# Altium project CAMERON.PrjPcb
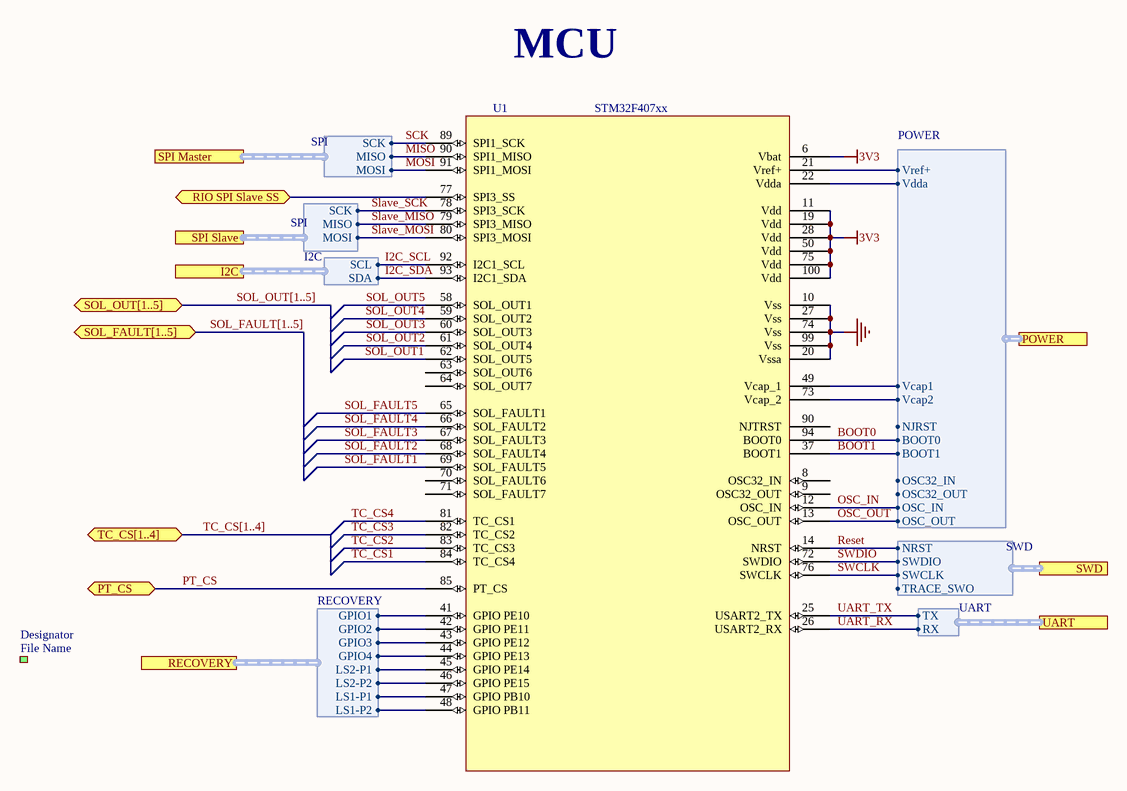
[diagram p0: RIO_MCU.SchDoc]
7 sheets, 17 parts. Net scope: hierarchical (ports join the sheet entries above them; power ports are global).
Board file: CAMERON.PcbDoc
Sheets:
  RIO_MCU.SchDoc
  SWD_Breakout.SchDoc
  Thermocouples.SchDoc
  Solenoids.SchDoc
  Flight_Computer.SchDoc
  XBee.SchDoc
  Power_Monitor.SchDoc

## Sheet RIO_MCU.SchDoc
size Letter; Organization: Altium Limited; Address1: L3, 12a Rodborough Rd; Address2: Frenchs Forest; Address3: NSW; Address4: Australia 2086

### Parts
U1  STM32F407xx  [LQFP100]

### Sub-sheets
Designator = File Name (file not in this document): no entries

### Ports
I2C (harness I2C), POWER (harness POWER), PT_CS (bidir), RECOVERY (harness RECOVERY), RIO SPI Slave SS (bidir), SOL_FAULT[1..5] (bidir), SOL_OUT[1..5] (bidir), SPI Master (harness SPI), SPI Slave (harness SPI), SWD (harness SWD), TC_CS[1..4] (bidir), UART (harness UART)

### Harnesses
I2C: SCL, SDA
SWD: NRST, SWDIO, SWCLK, TRACE_SWO
POWER: Vdda, Vref+, Vcap1, Vcap2, NJRST, BOOT0, BOOT1, OSC32_IN, OSC32_OUT, OSC_IN, OSC_OUT
SPI: SCK, MISO, MOSI
SPI: MISO, MOSI, SCK
UART: RX, TX
RECOVERY: GPIO1, GPIO2, GPIO3, GPIO4, LS1-P1, LS1-P2, LS2-P1, LS2-P2

### Nets
3V3: U1.6(Vbat) U1.11(Vdd) U1.19(Vdd) U1.28(Vdd) U1.50(Vdd) U1.75(Vdd) U1.100(Vdd)
GND: U1.10(Vss) U1.20(Vssa) U1.27(Vss) U1.74(Vss) U1.99(Vss)
BOOT0: U1.94(BOOT0) ; port POWER.BOOT0
BOOT1: U1.37(BOOT1) ; port POWER.BOOT1
I2C_SCL: U1.92(I2C1_SCL) ; port I2C.SCL
I2C_SDA: U1.93(I2C1_SDA) ; port I2C.SDA
MISO: U1.90(NJTRST) ; port SPI Master.MISO
MOSI: U1.91(SPI1_MOSI) ; port SPI Master.MOSI
OSC_IN: U1.12(OSC_IN) ; port POWER.OSC_IN
OSC_OUT: U1.13(OSC_OUT) ; port POWER.OSC_OUT
PT_CS: U1.85(PT_CS) ; port PT_CS
Reset: U1.14(NRST) ; port SWD.NRST
SCK: U1.89(SPI1_SCK) ; port SPI Master.SCK
Slave_MISO: U1.79(SPI3_MISO) ; port SPI Slave.MISO
Slave_MOSI: U1.80(SPI3_MOSI) ; port SPI Slave.MOSI
Slave_SCK: U1.78(SPI3_SCK) ; port SPI Slave.SCK
SOL_FAULT1: U1.69(SOL_FAULT5)
SOL_FAULT2: U1.68(SOL_FAULT4)
SOL_FAULT3: U1.67(SOL_FAULT3)
SOL_FAULT4: U1.66(SOL_FAULT2)
SOL_FAULT5: U1.65(SOL_FAULT1)
SOL_OUT1: U1.62(SOL_OUT5)
SOL_OUT2: U1.61(SOL_OUT4)
SOL_OUT3: U1.60(SOL_OUT3)
SOL_OUT4: U1.59(SOL_OUT2)
SOL_OUT5: U1.58(SOL_OUT1)
SWCLK: U1.76(SWCLK) ; port SWD.SWCLK
SWDIO: U1.72(SWDIO) ; port SWD.SWDIO
TC_CS1: U1.84(TC_CS4)
TC_CS2: U1.83(TC_CS3)
TC_CS3: U1.82(TC_CS2)
TC_CS4: U1.81(TC_CS1)
UART_RX: U1.26(USART2_RX) ; port UART.RX
UART_TX: U1.25(USART2_TX) ; port UART.TX
NetU1_21: U1.21(Vref+) ; port POWER.Vref+
NetU1_22: U1.22(Vdda) ; port POWER.Vdda
NetU1_41: U1.41(GPIO_PE10) ; port RECOVERY.GPIO1
NetU1_42: U1.42(GPIO_PE11) ; port RECOVERY.GPIO2
NetU1_43: U1.43(GPIO_PE12) ; port RECOVERY.GPIO3
NetU1_44: U1.44(GPIO_PE13) ; port RECOVERY.GPIO4
NetU1_45: U1.45(GPIO_PE14) ; port RECOVERY.LS2-P1
NetU1_46: U1.46(GPIO_PE15) ; port RECOVERY.LS2-P2
NetU1_47: U1.47(GPIO_PB10) ; port RECOVERY.LS1-P1
NetU1_48: U1.48(GPIO_PB11) ; port RECOVERY.LS1-P2
NetU1_49: U1.49(Vcap_1) ; port POWER.Vcap1
NetU1_73: U1.73(Vcap_2) ; port POWER.Vcap2
NetU1_77: U1.77(SPI3_SS) ; port RIO SPI Slave SS

Not connected (* = marked no-connect by the designer): U1 8(OSC32_IN) 9(OSC32_OUT) 63(SOL_OUT6) 64(SOL_OUT7) 70(SOL_FAULT6) 71(SOL_FAULT7)

### Buses and harness runs
bus SOL_FAULT[1..5] = port SOL_FAULT[1..5]
bus SOL_OUT[1..5] = port SOL_OUT[1..5]
bus TC_CS[1..4] = port TC_CS[1..4]

### Notes on the sheet
- MCU
- Title
- Size:
- Date:
- Letter
- Number:
- Time:
- Revision:
- Sheet
- of
- File:

## Sheet SWD_Breakout.SchDoc
size Letter; Organization: Altium Limited; Address1: L3, 12a Rodborough Rd; Address2: Frenchs Forest; Address3: NSW; Address4: Australia 2086
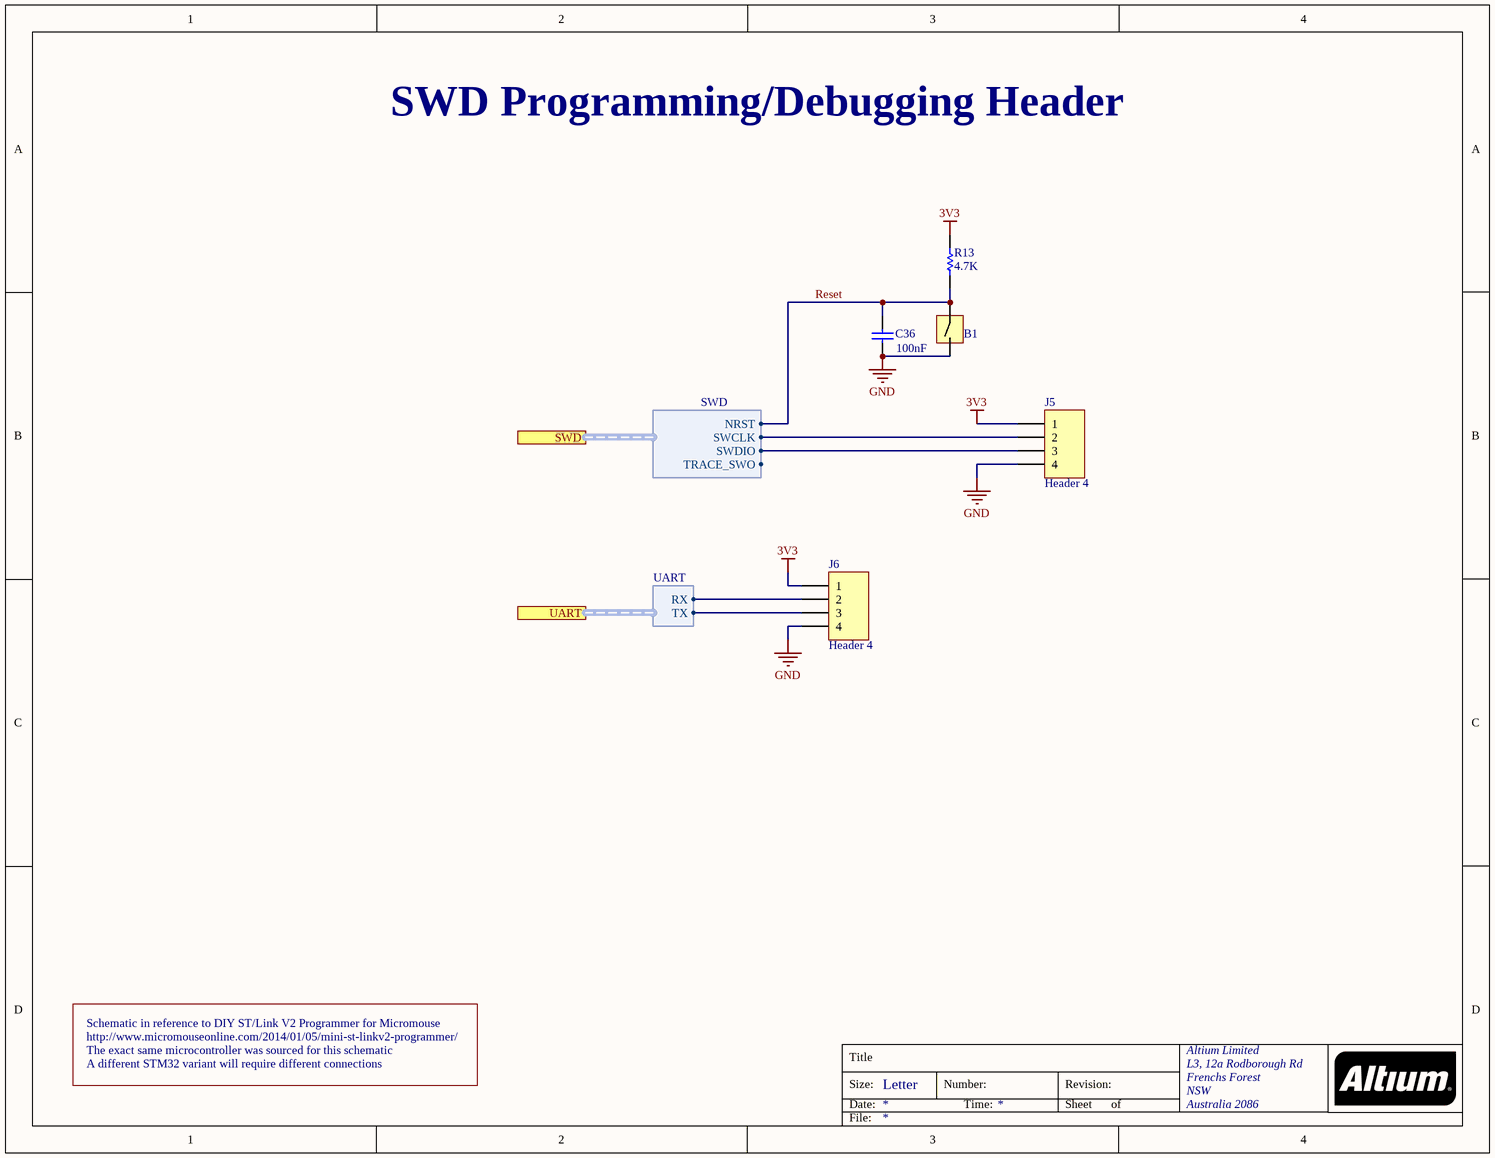
[diagram p1: SWD_Breakout.SchDoc]

### Parts
B1  Push Button  [PUSHBUTTON]  (value not drawn)
C36  value 100nF  [0603]  (hidden comment: Cap)
J5  Header 4  [HDR1X4]
J6  Header 4  [HDR1X4]
R13  value 4.7K  [0603]  (hidden comment: Res1)

### Ports
SWD (harness SWD), UART (harness UART)

### Harnesses
SWD: NRST, SWCLK, SWDIO, TRACE_SWO
UART: RX, TX

### Nets
3V3: J5.1 J6.1 R13.2
GND: B1.2 C36.1 J5.4 J6.4
Reset: B1.1 C36.2 R13.1 ; port SWD.NRST
NetJ5_2: J5.2 ; port SWD.SWCLK
NetJ5_3: J5.3 ; port SWD.SWDIO
NetJ6_2: J6.2 ; port UART.RX
NetJ6_3: J6.3 ; port UART.TX

### Notes on the sheet
- SWD Programming/Debugging Header
- http://www.micromouseonline.com/2014/01/05/mini-st-linkv2-programmer/
- Schematic in reference to DIY ST/Link V2 Programmer for Micromouse
- The exact same microcontroller was sourced for this schematic
- A different STM32 variant will require different connections
- Title
- Size:
- Date:
- Letter
- Number:
- Time:
- Revision:
- Sheet
- of
- File:

### Library data of the parts
B1 = PushButton
C36 = Cap: Capacitor
J5 J6 = Header 4: Header, 4-Pin; LatestRevisionDate: 17-Jul-2002; LatestRevisionNote: Re-released for DXP Platform.; Publisher: Altium Limited
R13 = Res1: Resistor

## Sheet Thermocouples.SchDoc
size Letter; Organization: Altium Limited; Address1: L3, 12a Rodborough Rd; Address2: Frenchs Forest; Address3: NSW; Address4: Australia 2086
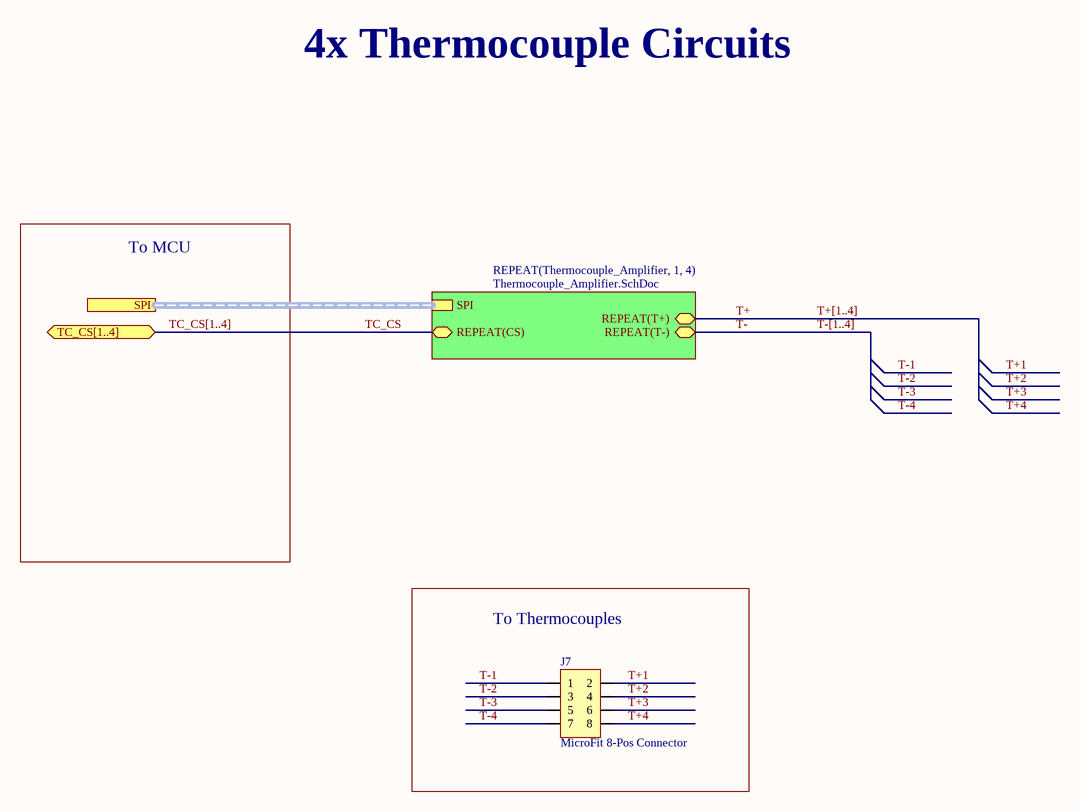
[diagram p2: Thermocouples.SchDoc]

### Parts
J7  MicroFit 8-Pos Connector  [Microfit-8Pos]

### Blocks framed on the sheet
To Thermocouples: J7

### Sub-sheets
REPEAT(Thermocouple_Amplifier, 1, 4) = Thermocouple_Amplifier.SchDoc (file not in this document): SPI (harness SPI), REPEAT(CS) (bidir), REPEAT(T+) (bidir), REPEAT(T-) (bidir)

### Ports
SPI (harness SPI), TC_CS[1..4] (bidir)

### Nets
T+: sheet REPEAT(Thermocouple_Amplifier, 1, 4)/REPEAT(T+)
T+1: J7.2
T+2: J7.4
T+3: J7.6
T+4: J7.8
T-: sheet REPEAT(Thermocouple_Amplifier, 1, 4)/REPEAT(T-)
T-1: J7.1
T-2: J7.3
T-3: J7.5
T-4: J7.7
TC_CS: sheet REPEAT(Thermocouple_Amplifier, 1, 4)/REPEAT(CS)

### Buses and harness runs
bus T+[1..4]
bus T-[1..4]
bus TC_CS[1..4] = port TC_CS[1..4]
harness port SPI = sheet REPEAT(Thermocouple_Amplifier, 1, 4)/SPI

### Notes on the sheet
- 4x Thermocouple Circuits
- To MCU
- Title
- Size:
- Date:
- Letter
- Number:
- Time:
- Revision:
- Sheet
- of
- File:

### Library data of the parts
J7 = Micro-Fit 8Pos: Molex MicroFit 8-Pos Connector; URL: https://www.digikey.com/products/en?WT.z_cid=sp_900_0310_buynow&keywords=430450813; DigiKey PN: WM2651-ND

## Sheet Solenoids.SchDoc
size Letter; Organization: Altium Limited; Address1: L3, 12a Rodborough Rd; Address2: Frenchs Forest; Address3: NSW; Address4: Australia 2086
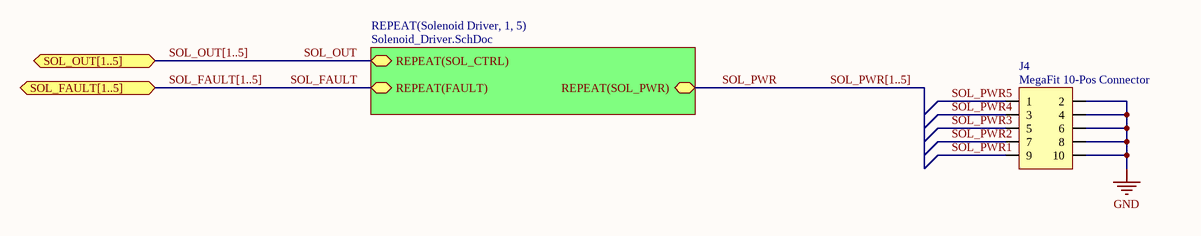
[diagram p3: Solenoids.SchDoc]

### Parts
J4  MegaFit 10-Pos Connector  [MegaFit-10Pos]

### Sub-sheets
REPEAT(Solenoid Driver, 1, 5) = Solenoid_Driver.SchDoc (file not in this document): REPEAT(FAULT) (bidir), REPEAT(SOL_CTRL) (bidir), REPEAT(SOL_PWR) (bidir)

### Ports
SOL_FAULT[1..5] (bidir), SOL_OUT[1..5] (bidir)

### Nets
GND: J4.2 J4.4 J4.6 J4.8 J4.10
SOL_FAULT: sheet REPEAT(Solenoid Driver, 1, 5)/REPEAT(FAULT)
SOL_OUT: sheet REPEAT(Solenoid Driver, 1, 5)/REPEAT(SOL_CTRL)
SOL_PWR: sheet REPEAT(Solenoid Driver, 1, 5)/REPEAT(SOL_PWR)
SOL_PWR1: J4.9
SOL_PWR2: J4.7
SOL_PWR3: J4.5
SOL_PWR4: J4.3
SOL_PWR5: J4.1

### Buses and harness runs
bus SOL_FAULT[1..5] = port SOL_FAULT[1..5]
bus SOL_OUT[1..5] = port SOL_OUT[1..5]
bus SOL_PWR[1..5]

### Notes on the sheet
- Title
- Size:
- Date:
- Letter
- Number:
- Time:
- Revision:
- Sheet
- of
- File:

### Library data of the parts
J4 = Mega-Fit 10Pos: Molex MegaFit 10-Pos Connector; URL: https://www.digikey.com/product-detail/en/molex-llc/0768290010/WM11979-ND/5639621; DigiKey PN: WM11979-ND

## Sheet Flight_Computer.SchDoc
size Letter; Organization: Altium Limited; Address1: L3, 12a Rodborough Rd; Address2: Frenchs Forest; Address3: NSW; Address4: Australia 2086
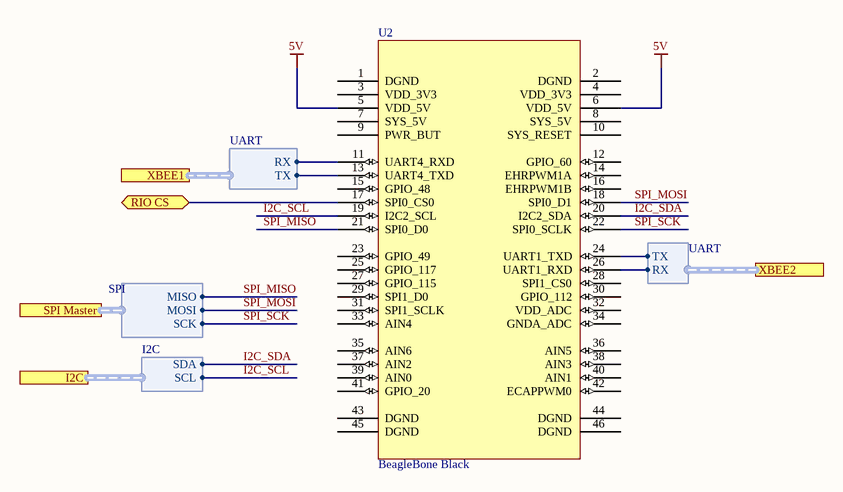
[diagram p4: Flight_Computer.SchDoc]

### Parts
U2  BeagleBone Black  [BeagleBoneBlack]

### Ports
I2C (harness I2C), RIO CS (bidir), SPI Master (harness SPI), XBEE1 (harness UART), XBEE2 (harness UART)

### Harnesses
SPI: MISO, MOSI, SCK
UART: TX, RX
I2C: SCL, SDA
UART: RX, TX

### Nets
5V: U2.5(VDD_5V) U2.6(VDD_5V)
I2C_SCL: U2.19(I2C2_SCL) ; port I2C.SCL
I2C_SDA: U2.20(I2C2_SDA) ; port I2C.SDA
SPI_MISO: U2.21(SPI0_D0) ; port SPI Master.MISO
SPI_MOSI: U2.18(SPI0_D1) ; port SPI Master.MOSI
SPI_SCK: U2.22(SPI0_SCLK) ; port SPI Master.SCK
NetU2_11: U2.11(UART4_RXD) ; port XBEE1.RX
NetU2_13: U2.13(UART4_TXD) ; port XBEE1.TX
NetU2_17: U2.17(SPI0_CS0) ; port RIO CS
NetU2_24: U2.24(UART1_TXD) ; port XBEE2.TX
NetU2_26: U2.26(UART1_RXD) ; port XBEE2.RX

Not connected (* = marked no-connect by the designer): U2 1(DGND) 2(DGND) 3(VDD_3V3) 4(VDD_3V3) 7(SYS_5V) 8(SYS_5V) 9(PWR_BUT) 10(SYS_RESET) 12(GPIO_60) 14(EHRPWM1A) 15(GPIO_48) 16(EHRPWM1B) 23(GPIO_49) 25(GPIO_117) 27(GPIO_115) 28(SPI1_CS0) 29(SPI1_D0) 30(GPIO_112) 31(SPI1_SCLK) 32(VDD_ADC) 33(AIN4) 34(GNDA_ADC) 35(AIN6) 36(AIN5) 37(AIN2) 38(AIN3) 39(AIN0) 40(AIN1) 41(GPIO_20) 42(ECAPPWM0) 43(DGND) 44(DGND) 45(DGND) 46(DGND)

### Notes on the sheet
- Title
- Size:
- Date:
- Letter
- Number:
- Time:
- Revision:
- Sheet
- of
- File:

### Library data of the parts
U2 = BeagleBone_Black: P9 Header of a BeagleBone Black

## Sheet XBee.SchDoc
size Letter; Organization: Altium Limited; Address1: L3, 12a Rodborough Rd; Address2: Frenchs Forest; Address3: NSW; Address4: Australia 2086
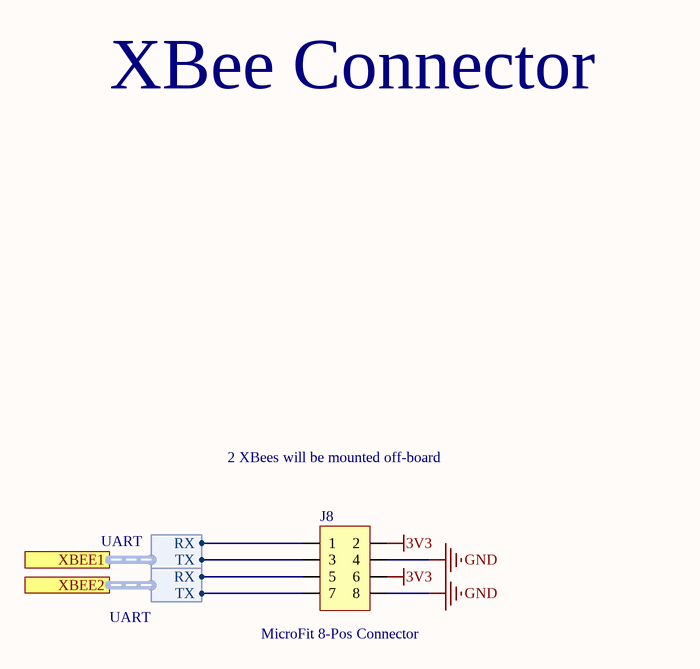
[diagram p5: XBee.SchDoc]

### Parts
J8  MicroFit 8-Pos Connector  [Microfit-8Pos]

### Ports
XBEE1 (harness UART), XBEE2 (harness UART)

### Harnesses
UART: RX, TX

### Nets
3V3: J8.2 J8.6
GND: J8.4 J8.8
NetJ8_1: J8.1 ; port XBEE1.RX
NetJ8_3: J8.3 ; port XBEE1.TX
NetJ8_5: J8.5 ; port XBEE2.RX
NetJ8_7: J8.7 ; port XBEE2.TX

### Notes on the sheet
- XBee Connector
- 2 XBees will be mounted off-board
- Title
- Size:
- Date:
- Letter
- Number:
- Time:
- Revision:
- Sheet
- of
- File:

### Library data of the parts
J8 = Micro-Fit 8Pos: Molex MicroFit 8-Pos Connector; URL: https://www.digikey.com/products/en?WT.z_cid=sp_900_0310_buynow&keywords=430450813; DigiKey PN: WM2651-ND

## Sheet Power_Monitor.SchDoc: Battery and Charger Breakouts
size A; Date: Dec 27, 2017; DrawnBy: Seyed Omid Hasanli; Revision: 1.0; SheetNumber: 12
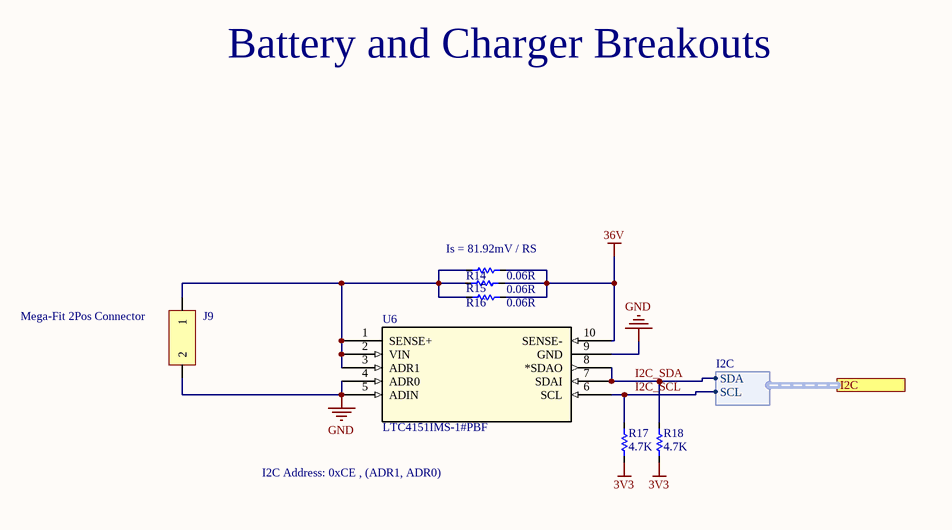
[diagram p6: Power_Monitor.SchDoc]

### Parts
J9  Mega-Fit 2Pos Connector  [MegaFit-2Pos]
R14  value 0.06R  [0603]  (hidden comment: Res)
R15  value 0.06R  [0603]  (hidden comment: Res)
R16  value 0.06R  [0603]  (hidden comment: Res)
R17  value 4.7K  [0603]  (hidden comment: Res)
R18  value 4.7K  [0603]  (hidden comment: Res)
U6  LTC4151IMS-1#PBF  [MSOP-10_MS]

### Ports
I2C (harness I2C)

### Harnesses
I2C: SCL, SDA

### Nets
3V3: R17.1 R18.1
36V: R14.2 R15.2 R16.2 U6.10(SENSE-)
GND: J9.2 U6.4(ADR0) U6.5(ADIN) U6.9(GND)
I2C_SCL: R17.2 U6.6(SCL) ; port I2C.SCL
I2C_SDA: R18.2 U6.7(SDAI) U6.8(*SDAO) ; port I2C.SDA
NetJ9_1: J9.1 R14.1 R15.1 R16.1 U6.1(SENSE+) U6.2(VIN) U6.3(ADR1)

### Notes on the sheet
- Battery and Charger Breakouts
- (near R14) Is = 81.92mV / RS
- I2C Address: 0xCE , (ADR1, ADR0)
- Title:
- DrawnBy:
- Revision:
- SheetNumber:
- Date:
- Datasheet Link:

### Library data of the parts
J9 = Mega-Fit 2Pos: Molex MegaFit 2-Pos Connector; URL: https://www.digikey.com/product-detail/en/molex-llc/0768290010/WM11979-ND/5639621; DigiKey PN: WM11979-ND
U6 = LTC4151IMS-1#PBF: Imported; Vendor: Linear Technology; C: Copyright (C) 2016 Accelerated Designs. All rights reserved; Manufacturer_Part_Number: ltc4151ims-1#pbf; Copyright: Copyright (C) 2016 Accelerated Designs. All rights reserved; Value: Value; Type: Type; RefDes: RefDes

## Nets that join several sheets
3V3: RIO_MCU (7 pins), SWD_Breakout (J5.1 J6.1 R13.2), XBee (J8.2 J8.6), Power_Monitor (R17.1 R18.1)
GND: RIO_MCU (5 pins), SWD_Breakout (B1.2 C36.1 J5.4 J6.4), Solenoids (5 pins), XBee (J8.4 J8.8), Power_Monitor (J9.2 U6.4 U6.5 U6.9)